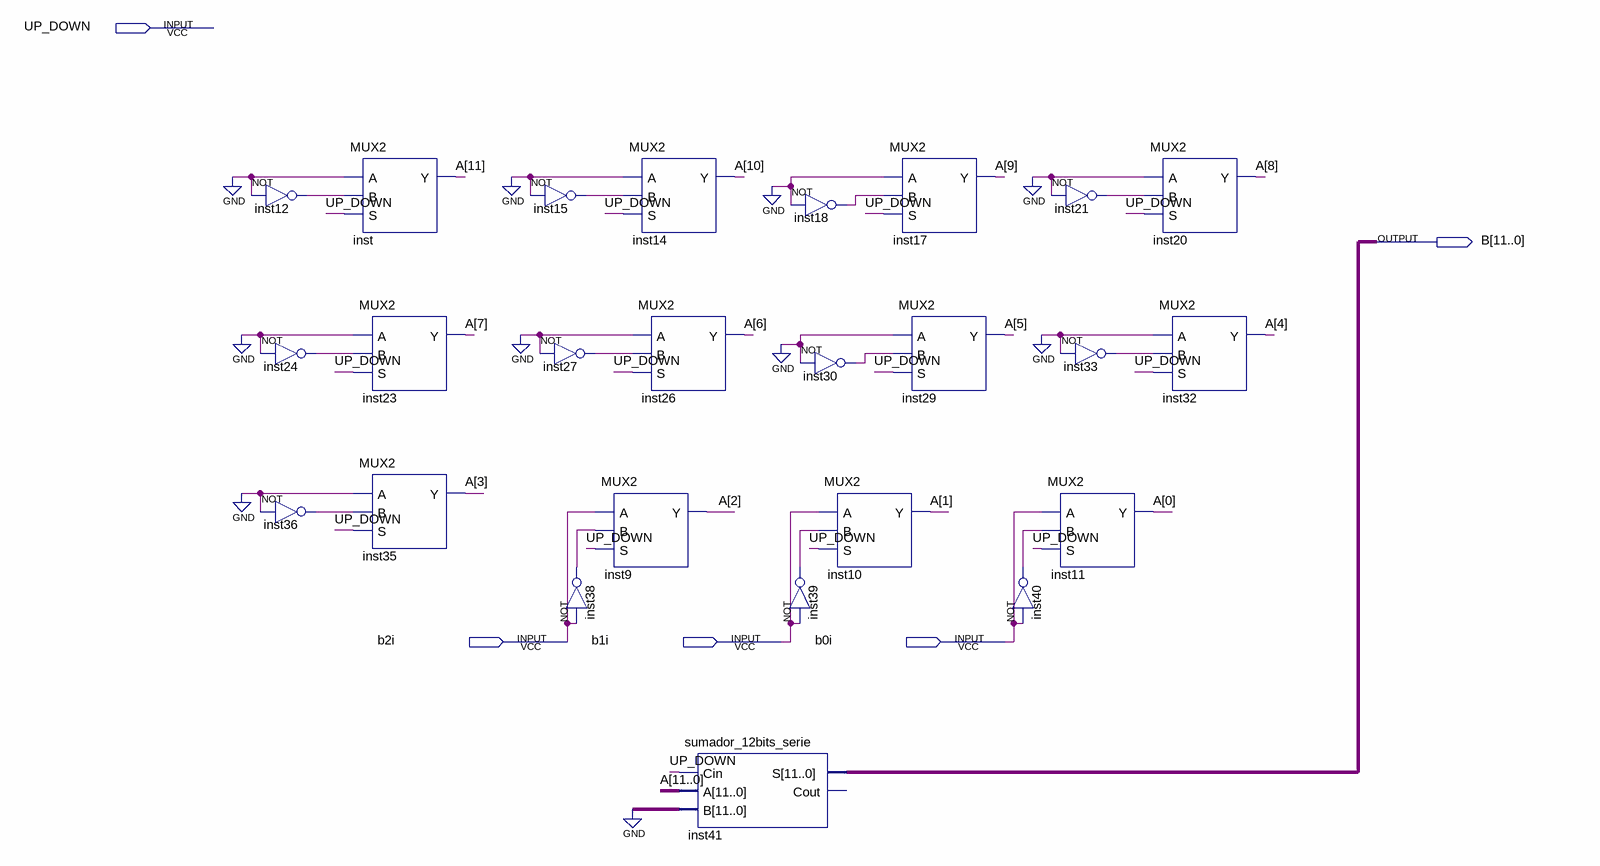
[diagram p0: schematic sheet]
// Quartus schematic conversorCA2.bdf as structural Verilog: 25 symbols, 5 pins
module conversorCA2 (
  input  UP_DOWN,
  input  b2i,
  input  b1i,
  input  b0i,
  output [11:0] B
);

  wire inst12_out, inst15_out, inst18_out, inst21_out, inst24_out, inst27_out, inst30_out, inst33_out,
       inst36_out, inst38_out, inst39_out, inst40_out;
  wire [11:0] A;

  not inst12 (inst12_out, 1'b0);
  not inst24 (inst24_out, 1'b0);
  not inst36 (inst36_out, 1'b0);
  MUX2 inst (.A(1'b0), .B(inst12_out), .S(UP_DOWN), .Y(A[11]));
  MUX2 inst23 (.A(1'b0), .B(inst24_out), .S(UP_DOWN), .Y(A[7]));
  MUX2 inst35 (.A(1'b0), .B(inst36_out), .S(UP_DOWN), .Y(A[3]));
  not inst15 (inst15_out, 1'b0);
  not inst27 (inst27_out, 1'b0);
  MUX2 inst9 (.A(b2i), .B(inst38_out), .S(UP_DOWN), .Y(A[2]));
  not inst38 (inst38_out, b2i);
  MUX2 inst14 (.A(1'b0), .B(inst15_out), .S(UP_DOWN), .Y(A[10]));
  MUX2 inst26 (.A(1'b0), .B(inst27_out), .S(UP_DOWN), .Y(A[6]));
  sumador_12bits_serie inst41 (.Cin(UP_DOWN), .A(A), .B({12{1'b0}}), .S(B));  // open: Cout
  not inst18 (inst18_out, 1'b0);
  not inst30 (inst30_out, 1'b0);
  MUX2 inst10 (.A(b1i), .B(inst39_out), .S(UP_DOWN), .Y(A[1]));
  not inst39 (inst39_out, b1i);
  MUX2 inst17 (.A(1'b0), .B(inst18_out), .S(UP_DOWN), .Y(A[9]));
  MUX2 inst29 (.A(1'b0), .B(inst30_out), .S(UP_DOWN), .Y(A[5]));
  not inst21 (inst21_out, 1'b0);
  not inst33 (inst33_out, 1'b0);
  MUX2 inst11 (.A(b0i), .B(inst40_out), .S(UP_DOWN), .Y(A[0]));
  not inst40 (inst40_out, b0i);
  MUX2 inst20 (.A(1'b0), .B(inst21_out), .S(UP_DOWN), .Y(A[8]));
  MUX2 inst32 (.A(1'b0), .B(inst33_out), .S(UP_DOWN), .Y(A[4]));
endmodule
